# Altium schematic sheet 2018_LUDICROUS_ENVIRONMENT_DEVICE.SchDoc
size A3
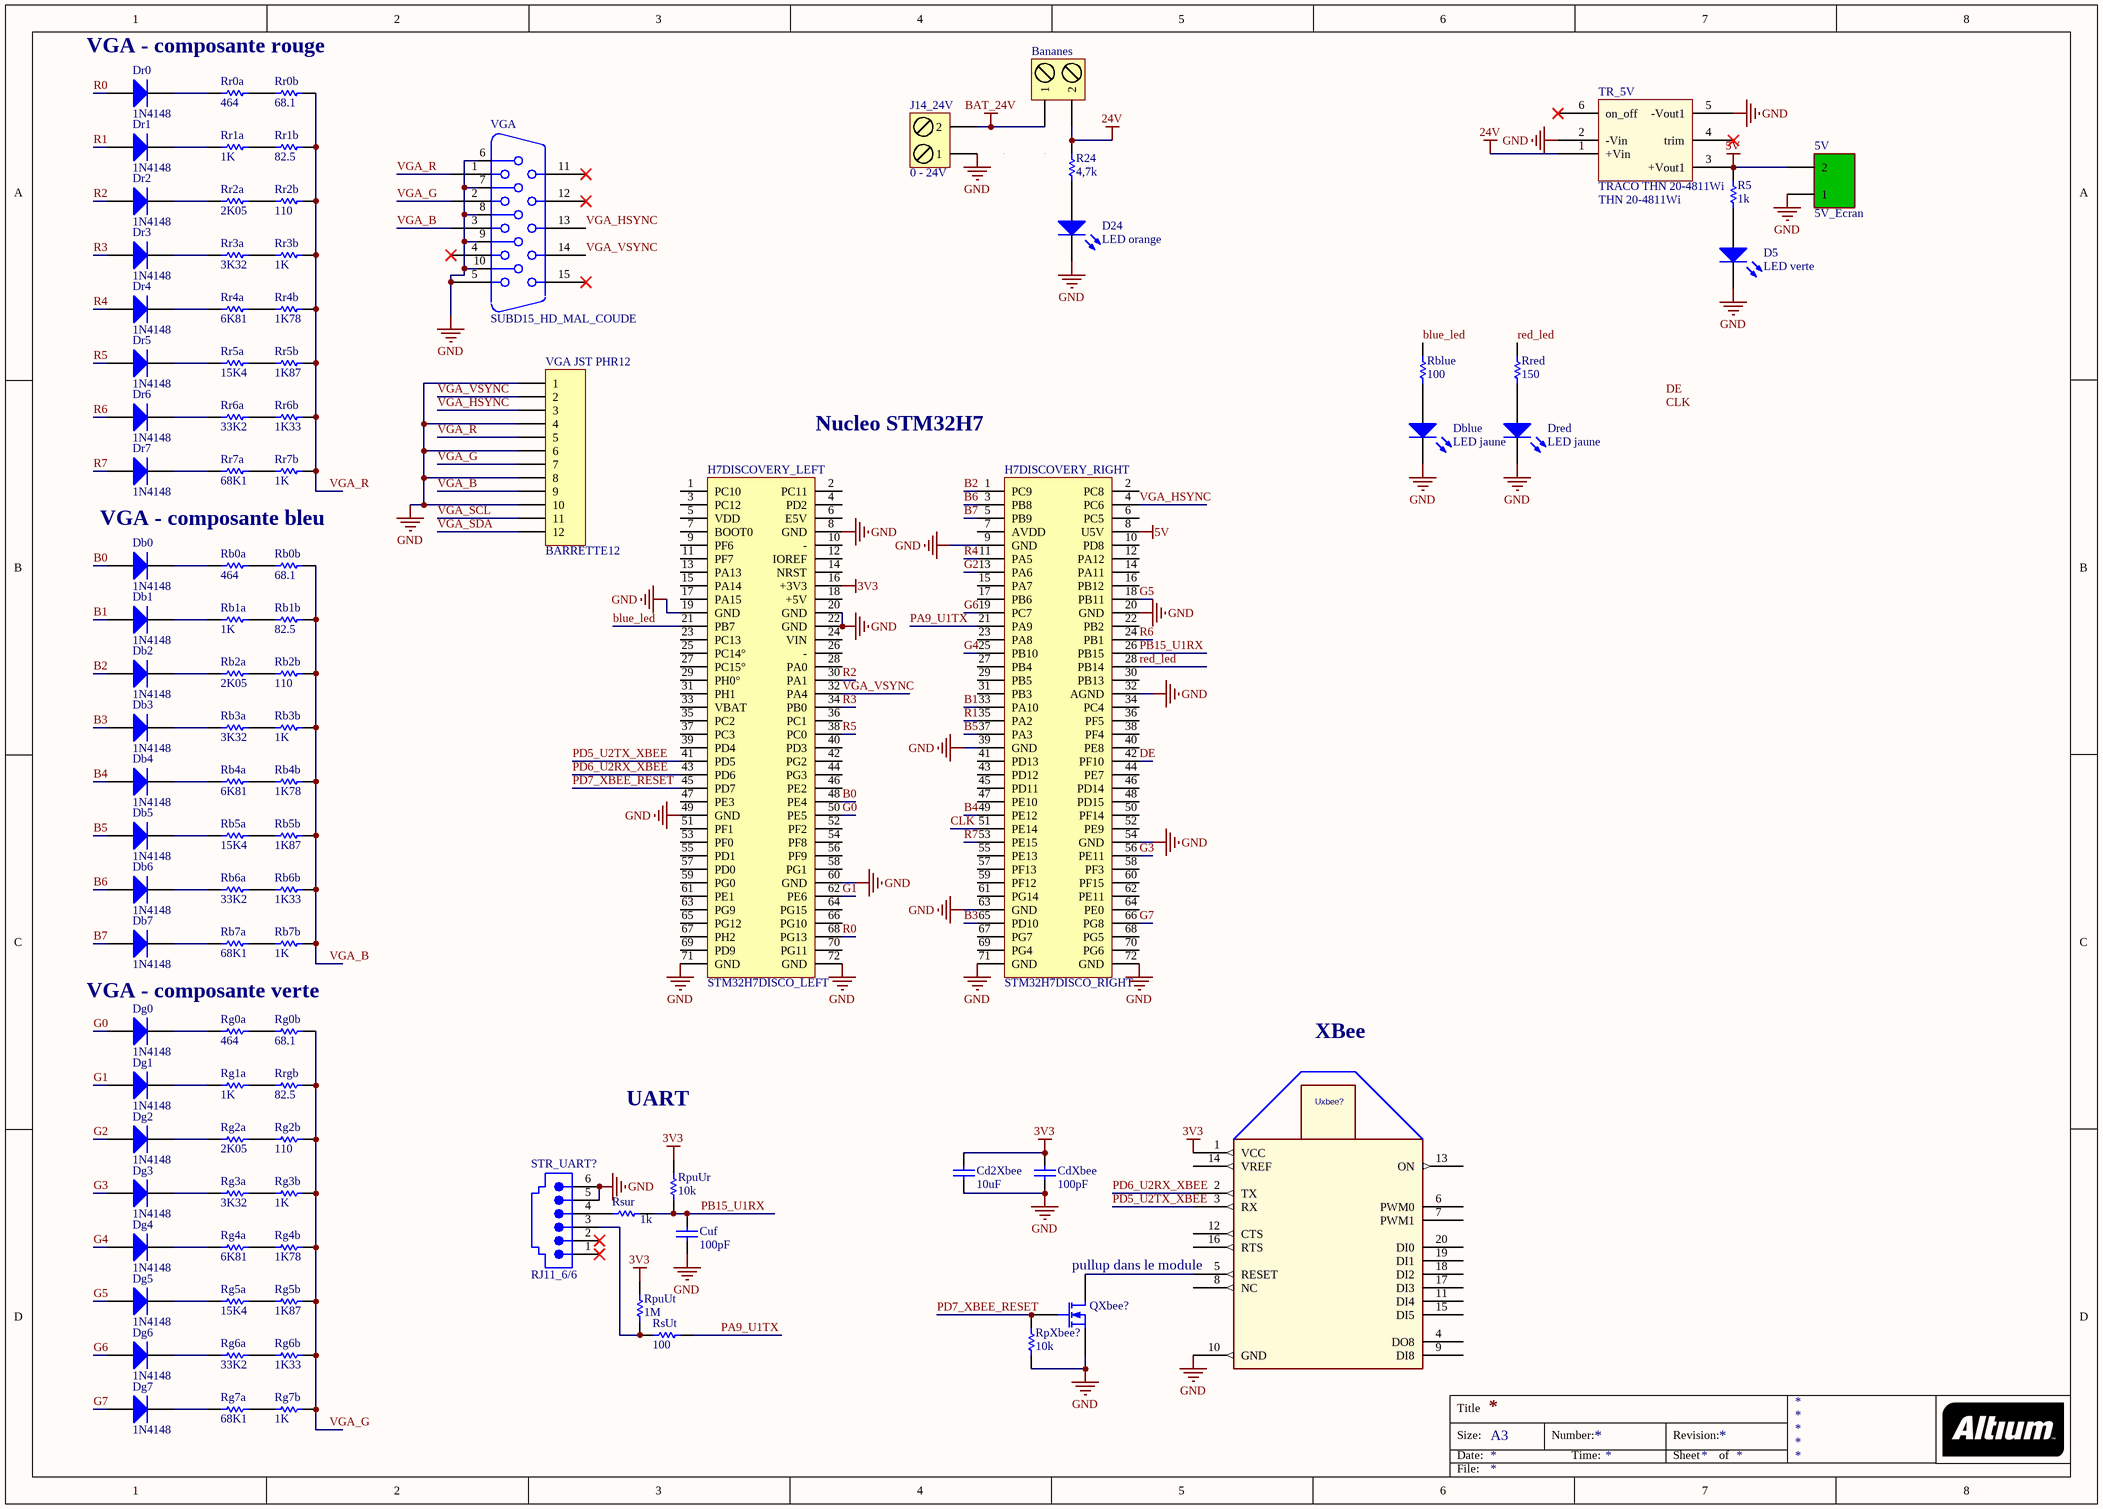
[diagram p0: 2018_LUDICROUS_ENVIRONMENT_DEVICE.SchDoc]

## Parts
5V  5V_Ecran  [BORNIER_2V_3.5MM]
Bananes  0 - 24V  [BORNIER2_FEM_COUDE]  (value not drawn)
Cd2Xbee  10uF  [C1206_N]
CdXbee  100pF  [C0805_N]
Cuf  100pF  [C0805_N]
D5  LED verte  [LED_0805]
D24  LED orange  [LED_0805]
Db0  1N4148  [SOD323]
Db1  1N4148  [SOD323]
Db2  1N4148  [SOD323]
Db3  1N4148  [SOD323]
Db4  1N4148  [SOD323]
Db5  1N4148  [SOD323]
Db6  1N4148  [SOD323]
Db7  1N4148  [SOD323]
Dblue  LED jaune  [LED_0805]
Dg0  1N4148  [SOD323]
Dg1  1N4148  [SOD323]
Dg2  1N4148  [SOD323]
Dg3  1N4148  [SOD323]
Dg4  1N4148  [SOD323]
Dg5  1N4148  [SOD323]
Dg6  1N4148  [SOD323]
Dg7  1N4148  [SOD323]
Dr0  1N4148  [SOD323]
Dr1  1N4148  [SOD323]
Dr2  1N4148  [SOD323]
Dr3  1N4148  [SOD323]
Dr4  1N4148  [SOD323]
Dr5  1N4148  [SOD323]
Dr6  1N4148  [SOD323]
Dr7  1N4148  [SOD323]
Dred  LED jaune  [LED_0805]
H7DISCOVERY_LEFT  STM32H7DISCO_LEFT  [HDR2X36]
H7DISCOVERY_RIGHT  STM32H7DISCO_RIGHT  [HDR2X36]
J14_24V  0 - 24V  [BORNIER2_FEM_COUDE]
QXbee?  Transistor MOSFET-N  [SOT23-3N]  (value not drawn)
R5  1k  [R1206_N]
R24  4,7k  [R1206_N]
Rb0a  464  [R0805_N]
Rb0b  68.1  [R0805_N]
Rb1a  1K  [R0805_N]
Rb1b  82.5  [R0805_N]
Rb2a  2K05  [R0805_N]
Rb2b  110  [R0805_N]
Rb3a  3K32  [R0805_N]
Rb3b  1K  [R0805_N]
Rb4a  6K81  [R0805_N]
Rb4b  1K78  [R0805_N]
Rb5a  15K4  [R0805_N]
Rb5b  1K87  [R0805_N]
Rb6a  33K2  [R0805_N]
Rb6b  1K33  [R0805_N]
Rb7a  68K1  [R0805_N]
Rb7b  1K  [R0805_N]
Rblue  100  [R1206_N]
Rg0a  464  [R0805_N]
Rg0b  68.1  [R0805_N]
Rg1a  1K  [R0805_N]
Rg2a  2K05  [R0805_N]
Rg2b  110  [R0805_N]
Rg3a  3K32  [R0805_N]
Rg3b  1K  [R0805_N]
Rg4a  6K81  [R0805_N]
Rg4b  1K78  [R0805_N]
Rg5a  15K4  [R0805_N]
Rg5b  1K87  [R0805_N]
Rg6a  33K2  [R0805_N]
Rg6b  1K33  [R0805_N]
Rg7a  68K1  [R0805_N]
Rg7b  1K  [R0805_N]
RpuUr  10k  [R1206_N]
RpuUt  1M  [R1206_N]
RpXbee?  10k  [R1206_N]
Rr0a  464  [R0805_N]
Rr0b  68.1  [R0805_N]
Rr1a  1K  [R0805_N]
Rr1b  82.5  [R0805_N]
Rr2a  2K05  [R0805_N]
Rr2b  110  [R0805_N]
Rr3a  3K32  [R0805_N]
Rr3b  1K  [R0805_N]
Rr4a  6K81  [R0805_N]
Rr4b  1K78  [R0805_N]
Rr5a  15K4  [R0805_N]
Rr5b  1K87  [R0805_N]
Rr6a  33K2  [R0805_N]
Rr6b  1K33  [R0805_N]
Rr7a  68K1  [R0805_N]
Rr7b  1K  [R0805_N]
Rred  150  [R1206_N]
Rrgb  82.5  [R0805_N]
Rsur  1k  [R1206_N]
RsUt  100  [R1206_N]
STR_UART?  RJ11_6/6  [RJ11_6/6 - Wurth Half Shielded Tab Down WR-MJ]
TR_5V  TRACO THN 20-4811Wi  Ref: THN 20-4811Wi  [TRACO_THN20]
Uxbee?  XBee  [MODULE_XBEE]  (value not drawn)
VGA  SUBD15_HD_MAL_COUDE  [SUBD15_MAL_COUDE_HD]
VGA_JST_PHR12  BARRETTE12  [JST PHR12]

## Nets
3V3: Cd2Xbee.2 CdXbee.2 H7DISCOVERY_LEFT.16(+3V3) RpuUr.2 RpuUt.2 Uxbee?.1(VCC)
5V: 5V.2 H7DISCOVERY_RIGHT.8(U5V) R5.2 TR_5V.3(+Vout1)
24V: Bananes.2 R24.2 TR_5V.1(+Vin)
BAT_24V: Bananes.1 J14_24V.2
GND: 5V.1 Cd2Xbee.1 CdXbee.1 Cuf.1 D5.2(K) D24.2(K) Dblue.2(K) Dred.2(K) H7DISCOVERY_LEFT.8(GND) H7DISCOVERY_LEFT.19(GND) H7DISCOVERY_LEFT.20(GND) H7DISCOVERY_LEFT.22(GND) H7DISCOVERY_LEFT.49(GND) H7DISCOVERY_LEFT.60(GND) H7DISCOVERY_LEFT.71(GND) H7DISCOVERY_LEFT.72(GND) H7DISCOVERY_RIGHT.9(GND) H7DISCOVERY_RIGHT.20(GND) H7DISCOVERY_RIGHT.32(AGND) H7DISCOVERY_RIGHT.39(GND) H7DISCOVERY_RIGHT.54(GND) H7DISCOVERY_RIGHT.63(GND) H7DISCOVERY_RIGHT.71(GND) H7DISCOVERY_RIGHT.72(GND) J14_24V.1 QXbee?.2(S) RpXbee?.2 STR_UART?.5 STR_UART?.6 TR_5V.2(-Vin) TR_5V.5(-Vout1) Uxbee?.10(GND) VGA.5 VGA.6 VGA.7 VGA.8 VGA.9 VGA.10 VGA_JST_PHR12.1 VGA_JST_PHR12.4 VGA_JST_PHR12.6 VGA_JST_PHR12.8 VGA_JST_PHR12.10
B0: Db0.1(A) H7DISCOVERY_LEFT.48(PE4)
B1: Db1.1(A) H7DISCOVERY_RIGHT.33(PA10)
B2: Db2.1(A) H7DISCOVERY_RIGHT.1(PC9)
B3: Db3.1(A) H7DISCOVERY_RIGHT.65(PD10)
B4: Db4.1(A) H7DISCOVERY_RIGHT.49(PE12)
B5: Db5.1(A) H7DISCOVERY_RIGHT.37(PA3)
B6: Db6.1(A) H7DISCOVERY_RIGHT.3(PB8)
B7: Db7.1(A) H7DISCOVERY_RIGHT.5(PB9)
blue_led: H7DISCOVERY_LEFT.21(PB7) Rblue.2
CLK: H7DISCOVERY_RIGHT.51(PE14)
DE: H7DISCOVERY_RIGHT.42(PF10)
G0: Dg0.1(A) H7DISCOVERY_LEFT.50(PE5)
G1: Dg1.1(A) H7DISCOVERY_LEFT.62(PE6)
G2: Dg2.1(A) H7DISCOVERY_RIGHT.13(PA6)
G3: Dg3.1(A) H7DISCOVERY_RIGHT.56(PE11)
G4: Dg4.1(A) H7DISCOVERY_RIGHT.25(PB10)
G5: Dg5.1(A) H7DISCOVERY_RIGHT.18(PB11)
G6: Dg6.1(A) H7DISCOVERY_RIGHT.19(PC7)
G7: Dg7.1(A) H7DISCOVERY_RIGHT.66(PG8)
PA9_U1TX: H7DISCOVERY_RIGHT.21(PA9) RsUt.2
PB15_U1RX: Cuf.2 H7DISCOVERY_RIGHT.26(PB15) RpuUr.1 Rsur.1
PD5_U2TX_XBEE: H7DISCOVERY_LEFT.41(PD5) Uxbee?.3(RX)
PD6_U2RX_XBEE: H7DISCOVERY_LEFT.43(PD6) Uxbee?.2(TX)
PD7_XBEE_RESET: H7DISCOVERY_LEFT.45(PD7) QXbee?.1(G) RpXbee?.1
R0: Dr0.1(A) H7DISCOVERY_LEFT.68(PG13)
R1: Dr1.1(A) H7DISCOVERY_RIGHT.35(PA2)
R2: Dr2.1(A) H7DISCOVERY_LEFT.30(PA1)
R3: Dr3.1(A) H7DISCOVERY_LEFT.34(PB0)
R4: Dr4.1(A) H7DISCOVERY_RIGHT.11(PA5)
R5: Dr5.1(A) H7DISCOVERY_LEFT.38(PC0)
R6: Dr6.1(A) H7DISCOVERY_RIGHT.24(PB1)
R7: Dr7.1(A) H7DISCOVERY_RIGHT.53(PE15)
red_led: H7DISCOVERY_RIGHT.28(PB14) Rred.2
VGA_B: Rb0b.2 Rb1b.2 Rb2b.2 Rb3b.2 Rb4b.2 Rb5b.2 Rb6b.2 Rb7b.2 VGA.3 VGA_JST_PHR12.9
VGA_G: Rg0b.2 Rg2b.2 Rg3b.2 Rg4b.2 Rg5b.2 Rg6b.2 Rg7b.2 Rrgb.2 VGA.2 VGA_JST_PHR12.7
VGA_HSYNC: H7DISCOVERY_RIGHT.4(PC6) VGA.13 VGA_JST_PHR12.3
VGA_R: Rr0b.2 Rr1b.2 Rr2b.2 Rr3b.2 Rr4b.2 Rr5b.2 Rr6b.2 Rr7b.2 VGA.1 VGA_JST_PHR12.5
VGA_SCL: VGA_JST_PHR12.11
VGA_SDA: VGA_JST_PHR12.12
VGA_VSYNC: H7DISCOVERY_LEFT.32(PA4) VGA.14 VGA_JST_PHR12.2
NetD5_1: D5.1(A) R5.1
NetD24_1: D24.1(A) R24.1
NetDb0_2: Db0.2(K) Rb0a.1
NetDb1_2: Db1.2(K) Rb1a.1
NetDb2_2: Db2.2(K) Rb2a.1
NetDb3_2: Db3.2(K) Rb3a.1
NetDb4_2: Db4.2(K) Rb4a.1
NetDb5_2: Db5.2(K) Rb5a.1
NetDb6_2: Db6.2(K) Rb6a.1
NetDb7_2: Db7.2(K) Rb7a.1
NetDblue_1: Dblue.1(A) Rblue.1
NetDg0_2: Dg0.2(K) Rg0a.1
NetDg1_2: Dg1.2(K) Rg1a.1
NetDg2_2: Dg2.2(K) Rg2a.1
NetDg3_2: Dg3.2(K) Rg3a.1
NetDg4_2: Dg4.2(K) Rg4a.1
NetDg5_2: Dg5.2(K) Rg5a.1
NetDg6_2: Dg6.2(K) Rg6a.1
NetDg7_2: Dg7.2(K) Rg7a.1
NetDr0_2: Dr0.2(K) Rr0a.1
NetDr1_2: Dr1.2(K) Rr1a.1
NetDr2_2: Dr2.2(K) Rr2a.1
NetDr3_2: Dr3.2(K) Rr3a.1
NetDr4_2: Dr4.2(K) Rr4a.1
NetDr5_2: Dr5.2(K) Rr5a.1
NetDr6_2: Dr6.2(K) Rr6a.1
NetDr7_2: Dr7.2(K) Rr7a.1
NetDred_1: Dred.1(A) Rred.1
NetQXbee?_3: QXbee?.3(D) Uxbee?.5(RESET)
NetRb0a_2: Rb0a.2 Rb0b.1
NetRb1a_2: Rb1a.2 Rb1b.1
NetRb2a_2: Rb2a.2 Rb2b.1
NetRb3a_2: Rb3a.2 Rb3b.1
NetRb4a_2: Rb4a.2 Rb4b.1
NetRb5a_2: Rb5a.2 Rb5b.1
NetRb6a_2: Rb6a.2 Rb6b.1
NetRb7a_2: Rb7a.2 Rb7b.1
NetRg0a_2: Rg0a.2 Rg0b.1
NetRg1a_2: Rg1a.2 Rrgb.1
NetRg2a_2: Rg2a.2 Rg2b.1
NetRg3a_2: Rg3a.2 Rg3b.1
NetRg4a_2: Rg4a.2 Rg4b.1
NetRg5a_2: Rg5a.2 Rg5b.1
NetRg6a_2: Rg6a.2 Rg6b.1
NetRg7a_2: Rg7a.2 Rg7b.1
NetRpuUt_1: RpuUt.1 RsUt.1 STR_UART?.3
NetRr0a_2: Rr0a.2 Rr0b.1
NetRr1a_2: Rr1a.2 Rr1b.1
NetRr2a_2: Rr2a.2 Rr2b.1
NetRr3a_2: Rr3a.2 Rr3b.1
NetRr4a_2: Rr4a.2 Rr4b.1
NetRr5a_2: Rr5a.2 Rr5b.1
NetRr6a_2: Rr6a.2 Rr6b.1
NetRr7a_2: Rr7a.2 Rr7b.1
NetRsur_2: Rsur.2 STR_UART?.4

Not connected (* = marked no-connect by the designer): H7DISCOVERY_LEFT 1(PC10) 2(PC11) 3(PC12) 4(PD2) 5(VDD) 6(E5V) 7(BOOT0) 9(PF6) 10(-) 11(PF7) 12(IOREF) 13(PA13) 14(NRST) 15(PA14) 17(PA15) 18(+5V) 23(PC13) 24(VIN) 25(PC14°) 26(-) 27(PC15°) 28(PA0) 29(PH0°) 31(PH1) 33(VBAT) 35(PC2) 36(PC1) 37(PC3) 39(PD4) 40(PD3) 42(PG2) 44(PG3) 46(PE2) 47(PE3) 51(PF1) 52(PF2) 53(PF0) 54(PF8) 55(PD1) 56(PF9) 57(PD0) 58(PG1) 59(PG0) 61(PE1) 63(PG9) 64(PG15) 65(PG12) 66(PG10) 67(PH2) 69(PD9) 70(PG11); H7DISCOVERY_RIGHT 2(PC8) 6(PC5) 7(AVDD) 10(PD8) 12(PA12) 14(PA11) 15(PA7) 16(PB12) 17(PB6) 22(PB2) 23(PA8) 27(PB4) 29(PB5) 30(PB13) 31(PB3) 34(PC4) 36(PF5) 38(PF4) 40(PE8) 41(PD13) 43(PD12) 44(PE7) 45(PD11) 46(PD14) 47(PE10) 48(PD15) 50(PF14) 52(PE9) 55(PE13) 57(PF13) 58(PF3) 59(PF12) 60(PF15) 61(PG14) 62(PE11) 64(PE0) 67(PG7) 68(PG5) 69(PG4) 70(PG6); STR_UART? 1* 2*; TR_5V 4(trim)* 6(on_off)*; Uxbee? 4(DO8) 6(PWM0) 7(PWM1) 8(NC) 9(DI8) 11(DI4) 12(CTS) 13(ON) 14(VREF) 15(DI5) 16(RTS) 17(DI3) 18(DI2) 19(DI1) 20(DI0); VGA 4* 11* 12* 15*

## Notes on the sheet
- VGA - composante rouge
- Nucleo STM32H7
- VGA - composante bleu
- VGA - composante verte
- XBee
- UART
- (near Uxbee?) pullup dans le module
- Labels drawn without touching a wire or pin: CLK, DE
- Title
- Size:
- Date:
- A3
- Number:
- Time:
- Revision:
- Sheet
- of
- File:

## Library data of the parts
5V = BORNIER_2V_3.5MM
Bananes J14_24V = BORNIER2: Terminal blocks, 2 pins, pitch=5mm
Cd2Xbee CdXbee Cuf = Condensateur: Capacitor; Published: 8-Jun-2000; LatestRevisionDate: 17-Jul-2002; LatestRevisionNote: Re-released for DXP Platform.; PackageReference: RAD-0.3; Publisher: Altium Limited
D5 D24 Dblue Dred = LED: Typical LED; Published: 8-Jun-2000; LatestRevisionDate: 08-Jul-2005; LatestRevisionNote: Mech Layer 1 removed.; PackageReference: LED-1; Publisher: Altium Limited
Db0-Db7 Dg0-Dg7 Dr0-Dr7 = Diode 1N4148: High Conductance Fast Diode; Published: 8-Jun-2000; LatestRevisionDate: 17-Jul-2002; LatestRevisionNote: Re-released for DXP Platform.; DatasheetVersion: 1997; PackageReference: DO-35; Publisher: Altium Limited; PackageDescription: Diode, Axial; Body 3.8 x 1.9 mm (LxDia. max), Lead Dia. 0.53 mm (max); Code_JEDEC: DO-204-AH; ComponentLink1Description: Manufacturer Link; ComponentLink1URL: http://www.fairchildsemi.com/; ComponentLink2Description: Datasheet; ComponentLink2URL: http://www.fairchildsemi.com/ds/1N%2F1N4148.pdf
QXbee? = Transistor MOSFET-N: N-Channel MOSFET; PackageDocument: 1995/1996; Published: 8-Jun-2000; LatestRevisionDate: 17-Jul-2002; LatestRevisionNote: Re-released for DXP Platform.; PackageReference: E3; Publisher: Altium Limited
R5 R24 Rb0a Rb0b Rb1a Rb1b Rb2a Rb2b Rb3a Rb3b Rb4a Rb4b Rb5a Rb5b Rb6a Rb6b Rb7a Rb7b Rblue Rg0a Rg0b Rg1a Rg2a Rg2b Rg3a Rg3b Rg4a Rg4b Rg5a Rg5b Rg6a Rg6b Rg7a Rg7b RpuUr RpuUt RpXbee? Rr0a Rr0b Rr1a Rr1b Rr2a Rr2b Rr3a Rr3b Rr4a Rr4b Rr5a Rr5b Rr6a Rr6b Rr7a Rr7b Rred Rrgb Rsur RsUt = Resistor: Published: 8-Jun-2000; LatestRevisionDate: 17-Jul-2002; LatestRevisionNote: Re-released for DXP Platform.; PackageReference: AXIAL-0.5; Publisher: Altium Limited
STR_UART? = RJ11_6/6: Right Angle, Standard Profile, Offset Latch DECconnect, Flangeless PCB Jack; Ports: 1; Positions/Loaded: Port1 - 6 Offset Latch/6; PerformanceCategory: 3; PCB_Mounting: Thru-Hole; DrillSize: Nominal, Rounded to nearest 0.05mm; PCB_Layout: Complies with Manufacturer's Recommendation.; Published: 25-Jun-2002; DatasheetDocument: 18-Dec-2001; PackageDocument: 18-Dec-2001; PackageReference: 15-43-6110; Publisher: Altium Limited; ComponentLink1Description: Manufacturer Link; ComponentLink1URL: http://www.molex.com/; ComponentLink2Description: Datasheet; ComponentLink2URL: http://www.molex.com/cmc_upload/common_files/1212003_41369catalogpage.pdf; Type: RJ11_6/6
TR_5V = TRACO THN 20-4811Wi: Traco 20W 24V to 5V*4A
VGA = SUBD15_HD_MAL_COUDE: Connector; SUBD; 15 Position; Male; Right Angle; High Density
VGA_JST_PHR12 = BARRETTE12: Header, 12-Pin; LatestRevisionDate: 17-Jul-2002; LatestRevisionNote: Re-released for DXP Platform.; Publisher: Altium Limited
H7DISCOVERY_LEFT = STM32H7DISCO_LEFT: LatestRevisionDate: 17-Jul-2002; LatestRevisionNote: Re-released for DXP Platform.; Publisher: Altium Limited
H7DISCOVERY_RIGHT = STM32H7DISCO_RIGHT: LatestRevisionDate: 17-Jul-2002; LatestRevisionNote: Re-released for DXP Platform.; Publisher: Altium Limited